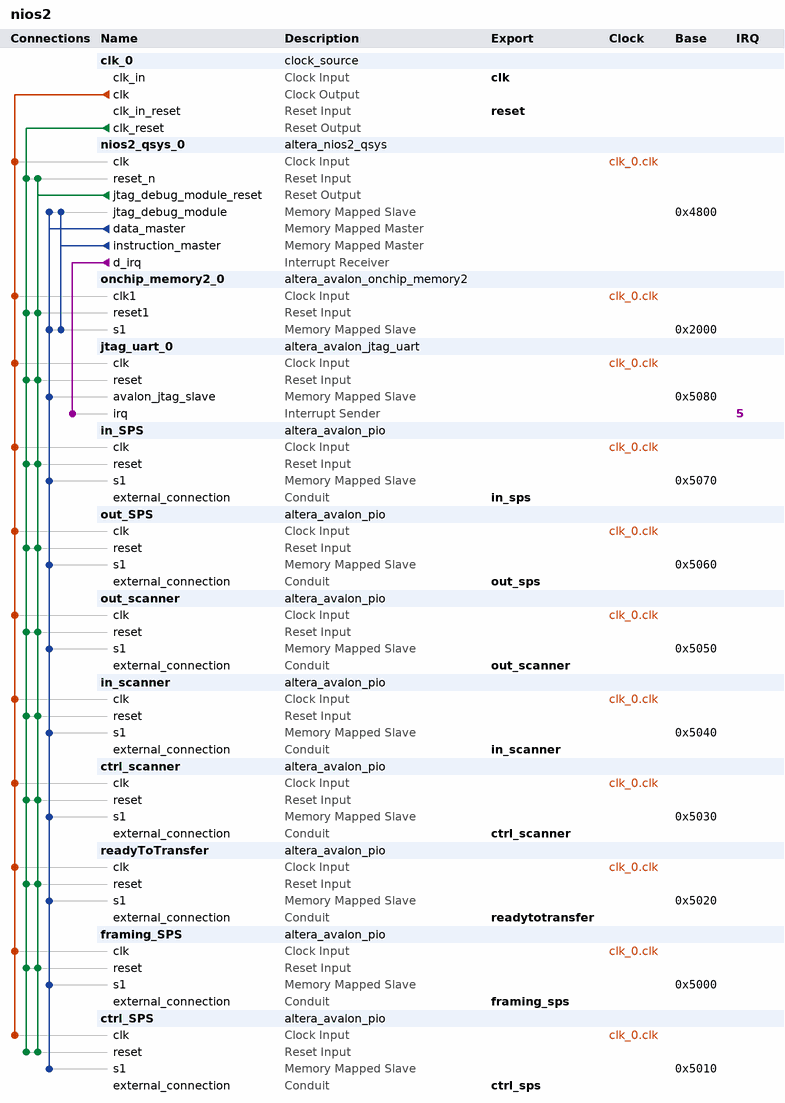
[diagram p0: system contents]
# Platform Designer (Qsys) system nios2, Cyclone V 5CSEMA5F31C6
# Parameters at their usual value, and those the tool derives, are not listed.
package require -exact qsys 16.0
create_system nios2
set_project_property DEVICE_FAMILY {Cyclone V}
set_project_property DEVICE 5CSEMA5F31C6

add_instance clk_0 clock_source 16.0
set_instance_parameter_value clk_0 clockFrequency 50000000

add_instance nios2_qsys_0 altera_nios2_qsys 16.0
set_instance_parameter_value nios2_qsys_0 breakSlave nios2_qsys_0.jtag_debug_module
set_instance_parameter_value nios2_qsys_0 exceptionSlave onchip_memory2_0.s1
set_instance_parameter_value nios2_qsys_0 icache_size 4096
set_instance_parameter_value nios2_qsys_0 impl Tiny
set_instance_parameter_value nios2_qsys_0 mmu_TLBMissExcSlave None
set_instance_parameter_value nios2_qsys_0 resetSlave onchip_memory2_0.s1
set_instance_parameter_value nios2_qsys_0 resetrequest_enabled true

add_instance onchip_memory2_0 altera_avalon_onchip_memory2 16.0
set_instance_parameter_value onchip_memory2_0 dataWidth 32
set_instance_parameter_value onchip_memory2_0 dualPort false
set_instance_parameter_value onchip_memory2_0 initMemContent true
set_instance_parameter_value onchip_memory2_0 initializationFileName onchip_mem.hex
set_instance_parameter_value onchip_memory2_0 memorySize 8192

add_instance jtag_uart_0 altera_avalon_jtag_uart 16.0
set_instance_parameter_value jtag_uart_0 simInteractiveOptions NO_INTERACTIVE_WINDOWS

add_instance in_SPS altera_avalon_pio 16.0
set_instance_parameter_value in_SPS direction Input
set_instance_parameter_value in_SPS width 8

add_instance out_SPS altera_avalon_pio 16.0
set_instance_parameter_value out_SPS direction Output
set_instance_parameter_value out_SPS width 8

add_instance out_scanner altera_avalon_pio 16.0
set_instance_parameter_value out_scanner direction Output
set_instance_parameter_value out_scanner width 8

add_instance in_scanner altera_avalon_pio 16.0
set_instance_parameter_value in_scanner direction Input
set_instance_parameter_value in_scanner width 8

add_instance ctrl_scanner altera_avalon_pio 16.0
set_instance_parameter_value ctrl_scanner direction Output
set_instance_parameter_value ctrl_scanner width 2

add_instance readyToTransfer altera_avalon_pio 16.0
set_instance_parameter_value readyToTransfer direction Input
set_instance_parameter_value readyToTransfer width 1

add_instance framing_SPS altera_avalon_pio 16.0
set_instance_parameter_value framing_SPS direction Input
set_instance_parameter_value framing_SPS width 2

add_instance ctrl_SPS altera_avalon_pio 16.0
set_instance_parameter_value ctrl_SPS direction Output
set_instance_parameter_value ctrl_SPS width 2

# connections
add_connection clk_0.clk ctrl_scanner.clk clock
add_connection clk_0.clk ctrl_SPS.clk clock
add_connection clk_0.clk framing_SPS.clk clock
add_connection clk_0.clk in_scanner.clk clock
add_connection clk_0.clk in_SPS.clk clock
add_connection clk_0.clk jtag_uart_0.clk clock
add_connection clk_0.clk nios2_qsys_0.clk clock
add_connection clk_0.clk onchip_memory2_0.clk1 clock
add_connection clk_0.clk out_scanner.clk clock
add_connection clk_0.clk out_SPS.clk clock
add_connection clk_0.clk readyToTransfer.clk clock
add_connection clk_0.clk_reset ctrl_scanner.reset reset
add_connection clk_0.clk_reset ctrl_SPS.reset reset
add_connection clk_0.clk_reset framing_SPS.reset reset
add_connection clk_0.clk_reset in_scanner.reset reset
add_connection clk_0.clk_reset in_SPS.reset reset
add_connection clk_0.clk_reset jtag_uart_0.reset reset
add_connection clk_0.clk_reset nios2_qsys_0.reset_n reset
add_connection clk_0.clk_reset onchip_memory2_0.reset1 reset
add_connection clk_0.clk_reset out_scanner.reset reset
add_connection clk_0.clk_reset out_SPS.reset reset
add_connection clk_0.clk_reset readyToTransfer.reset reset
add_connection nios2_qsys_0.jtag_debug_module_reset ctrl_scanner.reset reset
add_connection nios2_qsys_0.jtag_debug_module_reset ctrl_SPS.reset reset
add_connection nios2_qsys_0.jtag_debug_module_reset framing_SPS.reset reset
add_connection nios2_qsys_0.jtag_debug_module_reset in_scanner.reset reset
add_connection nios2_qsys_0.jtag_debug_module_reset in_SPS.reset reset
add_connection nios2_qsys_0.jtag_debug_module_reset jtag_uart_0.reset reset
add_connection nios2_qsys_0.jtag_debug_module_reset nios2_qsys_0.reset_n reset
add_connection nios2_qsys_0.jtag_debug_module_reset onchip_memory2_0.reset1 reset
add_connection nios2_qsys_0.jtag_debug_module_reset out_scanner.reset reset
add_connection nios2_qsys_0.jtag_debug_module_reset out_SPS.reset reset
add_connection nios2_qsys_0.jtag_debug_module_reset readyToTransfer.reset reset
add_connection nios2_qsys_0.data_master ctrl_scanner.s1 avalon
set_connection_parameter_value nios2_qsys_0.data_master/ctrl_scanner.s1 baseAddress 0x5030
add_connection nios2_qsys_0.data_master ctrl_SPS.s1 avalon
set_connection_parameter_value nios2_qsys_0.data_master/ctrl_SPS.s1 baseAddress 0x5010
add_connection nios2_qsys_0.data_master framing_SPS.s1 avalon
set_connection_parameter_value nios2_qsys_0.data_master/framing_SPS.s1 baseAddress 0x5000
add_connection nios2_qsys_0.data_master in_scanner.s1 avalon
set_connection_parameter_value nios2_qsys_0.data_master/in_scanner.s1 baseAddress 0x5040
add_connection nios2_qsys_0.data_master in_SPS.s1 avalon
set_connection_parameter_value nios2_qsys_0.data_master/in_SPS.s1 baseAddress 0x5070
add_connection nios2_qsys_0.data_master jtag_uart_0.avalon_jtag_slave avalon
set_connection_parameter_value nios2_qsys_0.data_master/jtag_uart_0.avalon_jtag_slave baseAddress 0x5080
add_connection nios2_qsys_0.data_master nios2_qsys_0.jtag_debug_module avalon
set_connection_parameter_value nios2_qsys_0.data_master/nios2_qsys_0.jtag_debug_module baseAddress 0x4800
add_connection nios2_qsys_0.data_master onchip_memory2_0.s1 avalon
set_connection_parameter_value nios2_qsys_0.data_master/onchip_memory2_0.s1 baseAddress 0x2000
add_connection nios2_qsys_0.data_master out_scanner.s1 avalon
set_connection_parameter_value nios2_qsys_0.data_master/out_scanner.s1 baseAddress 0x5050
add_connection nios2_qsys_0.data_master out_SPS.s1 avalon
set_connection_parameter_value nios2_qsys_0.data_master/out_SPS.s1 baseAddress 0x5060
add_connection nios2_qsys_0.data_master readyToTransfer.s1 avalon
set_connection_parameter_value nios2_qsys_0.data_master/readyToTransfer.s1 baseAddress 0x5020
add_connection nios2_qsys_0.instruction_master nios2_qsys_0.jtag_debug_module avalon
set_connection_parameter_value nios2_qsys_0.instruction_master/nios2_qsys_0.jtag_debug_module baseAddress 0x4800
add_connection nios2_qsys_0.instruction_master onchip_memory2_0.s1 avalon
set_connection_parameter_value nios2_qsys_0.instruction_master/onchip_memory2_0.s1 baseAddress 0x2000
add_connection nios2_qsys_0.d_irq jtag_uart_0.irq interrupt
set_connection_parameter_value nios2_qsys_0.d_irq/jtag_uart_0.irq irqNumber 5

# exported interfaces
add_interface clk clock sink
set_interface_property clk EXPORT_OF clk_0.clk_in
add_interface ctrl_scanner conduit end
set_interface_property ctrl_scanner EXPORT_OF ctrl_scanner.external_connection
add_interface ctrl_sps conduit end
set_interface_property ctrl_sps EXPORT_OF ctrl_SPS.external_connection
add_interface framing_sps conduit end
set_interface_property framing_sps EXPORT_OF framing_SPS.external_connection
add_interface in_scanner conduit end
set_interface_property in_scanner EXPORT_OF in_scanner.external_connection
add_interface in_sps conduit end
set_interface_property in_sps EXPORT_OF in_SPS.external_connection
add_interface out_scanner conduit end
set_interface_property out_scanner EXPORT_OF out_scanner.external_connection
add_interface out_sps conduit end
set_interface_property out_sps EXPORT_OF out_SPS.external_connection
add_interface readytotransfer conduit end
set_interface_property readytotransfer EXPORT_OF readyToTransfer.external_connection
add_interface reset reset sink
set_interface_property reset EXPORT_OF clk_0.clk_in_reset

set_interconnect_requirement {$system} qsys_mm.clockCrossingAdapter HANDSHAKE
set_interconnect_requirement {$system} qsys_mm.enableEccProtection FALSE
set_interconnect_requirement {$system} qsys_mm.insertDefaultSlave FALSE
set_interconnect_requirement {$system} qsys_mm.maxAdditionalLatency 1

save_system nios2.qsys
